# Altium project STM32_demo.PrjPcb
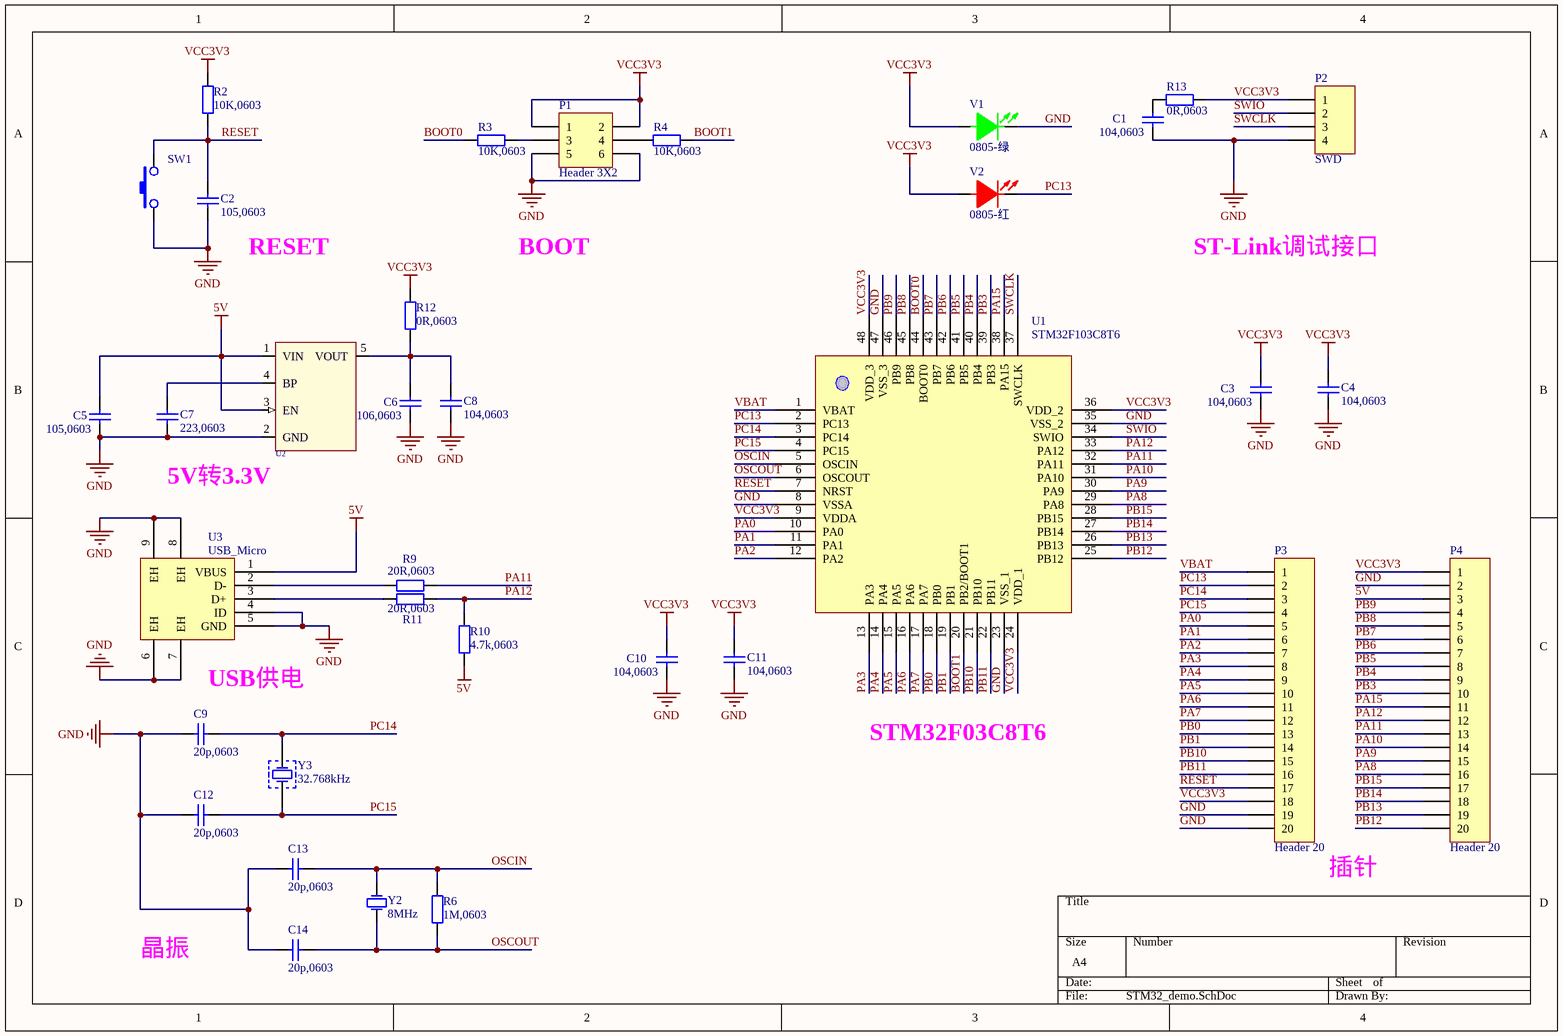
[diagram p0: STM32_demo.SchDoc]
1 sheet, 35 parts. Net scope: global (net labels, ports and power ports of the same name join across sheets).
Board file: STM32_demo.PcbDoc

## Sheet STM32_demo.SchDoc
size A4

### Parts
C1  104,0603  [C0603]
C2  105,0603  [C0603]
C3  104,0603  [C0603]
C4  104,0603  [C0603]
C5  105,0603  [C0603]
C6  106,0603  [C0603]
C7  223,0603  [C0603]
C8  104,0603  [C0603]
C9  20p,0603  [C0603]
C10  104,0603  [C0603]
C11  104,0603  [C0603]
C12  20p,0603  [C0603]
C13  20p,0603  [C0603]
C14  20p,0603  [C0603]
P1  Header 3X2  [HDR2X3]
P2  SWD  [HDR1X4H]
P3  Header 20  [HDR1X20]
P4  Header 20  [HDR1X20]
R2  10K,0603  [R0603]
R3  10K,0603  [R0603]
R4  10K,0603  [R0603]
R6  1M,0603  [R0603]
R9  20R,0603  [R0603]
R10  4.7k,0603  [R0603]
R11  20R,0603  [R0603]
R12  0R,0603  [R0603]
R13  0R,0603  [R0603]
SW1  (no value)  [KEY-SMT]
U1  STM32F103C8T6  [48P]
U2  RT9193  [SOT-23-5]  (value not drawn)
U3  USB_Micro  [micro_usb_jlc]
V1  value 0805-绿  [LED0805-G]  (hidden comment: WZYG0805-DTZ(绿/片式/70mcd))
V2  value 0805-红  [LED0805-R]  (hidden comment: FSL-R2210040HR-TNWSD(红/片式/112mcd))
Y2  value 8MHz  [XTL-HC49S-SMD-2P]  (hidden comment: 20MHz-8pF-20ppm/HC49S-SMD/明德亨)
Y3  value 32.768kHz  [XTL-3215SMD]  (hidden comment: 32.768kHz-12.5pF-20ppm/XTL-3215/CITIZEN(国标RoHS、欧盟RoHS2.0、REACH))

### Nets
5V: C5.2 P4.3 R10.2 U2.1(VIN) U2.3(EN) U3.1(VBUS)
GND: C1.1 C2.1 C3.1 C4.1 C5.1 C6.1 C7.1 C8.1 C9.2 C10.1 C11.1 C12.2 C13.2 C14.2 P1.5 P1.6 P2.4 P3.19 P3.20 P4.2 SW1.1 U1.8(VSSA) U1.23(VSS_1) U1.35(VSS_2) U1.47(VSS_3) U2.2(GND) U3.4(ID) U3.5(GND) U3.6(EH) U3.7(EH) U3.8(EH) U3.9(EH) V1.K
VCC3V3: C3.2 C4.2 C10.2 C11.2 P1.1 P1.2 P2.1 P3.18 P4.1 R2.2 R12.2 R13.1 U1.9(VDDA) U1.24(VDD_1) U1.36(VDD_2) U1.48(VDD_3) V1.A V2.A
BOOT0: R3.1 U1.44(BOOT0)
BOOT1: R4.2 U1.20(PB2/BOOT1)
OSCIN: C13.1 R6.1 U1.5(OSCIN) Y2.2(OSC2)
OSCOUT: C14.1 R6.2 U1.6(OSCOUT) Y2.1(OSC1)
PA0: P3.5 U1.10(PA0)
PA1: P3.6 U1.11(PA1)
PA2: P3.7 U1.12(PA2)
PA3: P3.8 U1.13(PA3)
PA4: P3.9 U1.14(PA4)
PA5: P3.10 U1.15(PA5)
PA6: P3.11 U1.16(PA6)
PA7: P3.12 U1.17(PA7)
PA8: P4.16 U1.29(PA8)
PA9: P4.15 U1.30(PA9)
PA10: P4.14 U1.31(PA10)
PA11: P4.13 R9.1 U1.32(PA11)
PA12: P4.12 R10.1 R11.1 U1.33(PA12)
PA15: P4.11 U1.38(PA15)
PB0: P3.13 U1.18(PB0)
PB1: P3.14 U1.19(PB1)
PB3: P4.10 U1.39(PB3)
PB4: P4.9 U1.40(PB4)
PB5: P4.8 U1.41(PB5)
PB6: P4.7 U1.42(PB6)
PB7: P4.6 U1.43(PB7)
PB8: P4.5 U1.45(PB8)
PB9: P4.4 U1.46(PB9)
PB10: P3.15 U1.21(PB10)
PB11: P3.16 U1.22(PB11)
PB12: P4.20 U1.25(PB12)
PB13: P4.19 U1.26(PB13)
PB14: P4.18 U1.27(PB14)
PB15: P4.17 U1.28(PB15)
PC13: P3.2 U1.2(PC13) V2.K
PC14: C9.1 P3.3 U1.3(PC14) Y3.2(OSC2)
PC15: C12.1 P3.4 U1.4(PC15) Y3.1(OSC1)
RESET: C2.2 P3.17 R2.1 SW1.2 U1.7(NRST)
SWCLK: P2.3 U1.37(SWCLK)
SWIO: P2.2 U1.34(SWIO)
VBAT: P3.1 U1.1(VBAT)
NetC1_2: C1.2 R13.2
NetC6_2: C6.2 C8.2 R12.1 U2.5(VOUT)
NetC7_2: C7.2 U2.4(BP)
NetP1_3: P1.3 R3.2
NetP1_4: P1.4 R4.1
NetR9_2: R9.2 U3.2(D-)
NetR11_2: R11.2 U3.3(D+)

### Notes on the sheet
- (near C2) RESET
- BOOT
- ST-Link调试接口
- 5V转3.3V
- USB供电
- STM32F03C8T6
- 插针
- 晶振

### Library data of the parts
C1-C14 = Cap: Capacitor; Value: 104; Published: 8-Jun-2000; LatestRevisionDate: 17-Jul-2002; LatestRevisionNote: Re-released for DXP Platform.; Publisher: Altium Limited
P1 = Header 3X2: Header, 3-Pin, Dual row; LatestRevisionDate: 17-Jul-2002; LatestRevisionNote: Re-released for DXP Platform.; Publisher: Altium Limited
P2 = Header 4: Header, 4-Pin; LatestRevisionDate: 17-Jul-2002; LatestRevisionNote: Re-released for DXP Platform.; Publisher: Altium Limited
P3 P4 = Header 20: Header, 20-Pin; LatestRevisionDate: 17-Jul-2002; LatestRevisionNote: Re-released for DXP Platform.; Publisher: Altium Limited
R2-R4 R6 R9-R13 = Res2: Resistor; Published: 8-Jun-2000; LatestRevisionDate: 17-Jul-2002; LatestRevisionNote: Re-released for DXP Platform.; Publisher: Altium Limited
SW1 = SW-PB_V: SWITCH
U2 = RT9193X_5P: ICA_MFR_NAME: RICHTEK; ICA_PARTNUM: $$2191094$$RT9193-15CU5; Part Number: TMP-13
U3 = micro_usb
V1 = 3041000169: 物料名称: 发光二极管; 制造商: 珠海市万州光电科技有限公司; 正向电压VF(V): 1.8; 正向测试电流IF(mA): 30; 最大正向电流IFM(mA): 0; 发光强度LI@IF(mcd): 70; 发光颜色: 绿; 形状结构: 片式; Latest Revision Date: 20210805; Material Code: 3041000169; 代理商: 珠海市万州光电科技有限公司
V2 = 3040110122: 物料名称: 发光二极管; 制造商: 苏州市悠越电子有限公司; 代理商: 杭州超视科技有限公司; 正向电压VF(V): 1.8; 正向测试电流IF(mA): 20; 最大正向电流IFM(mA): 0; 发光强度LI@IF(mcd): 112; 发光颜色: 红; 形状结构: 片式; Latest Revision Date: 20210805; Material Code: 3040110122
Y2 = 3060110011: 物料名称: 无源晶振; 制造商: 烟台明德亨电子科技有限公司; 标称频率: 20MHz; 频率容限Δf/f(ppm): 20; 负载电容(pF): 8; 晶振类型: 无源; Latest Revision Date: 20210728; Material Code: 3060110011; 代理商: 烟台明德亨电子科技有限公司; 封装形式: HC49S-SMD
Y3 = 3061000009: 物料名称: 无源晶振; 制造商: CITIZEN FINEDEVICE CO., LTD.; 代理商: 上海创邦国际贸易有限公司; 频率容限Δf/f(ppm): 20; 负载电容(pF): 12.5; 晶振类型: 无源; Latest Revision Date: 20210728; Material Code: 3061000009; 标称频率: 32.768kHz; 封装形式: XTL-3215